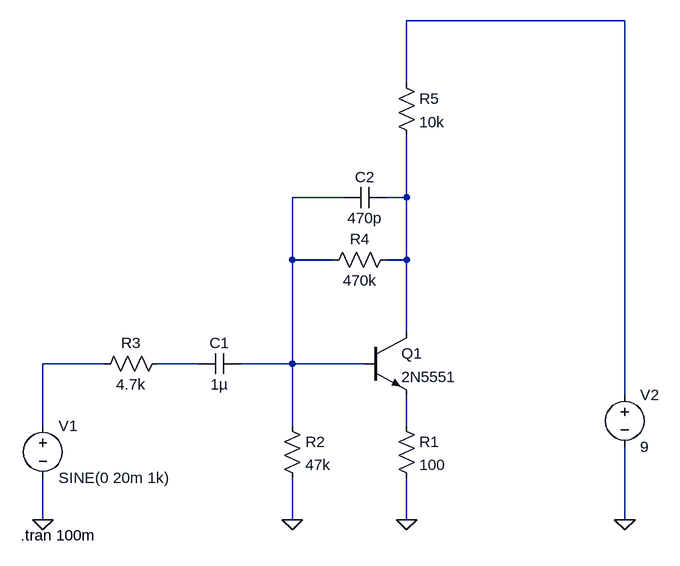
[diagram p0: schematic input_bjt_stage.asc]
input_bjt_stage.asc, the LTspice schematic file:
Version 4
SHEET 1 880 680
WIRE 576 -352 240 -352
WIRE 240 -256 240 -352
WIRE 144 -80 64 -80
WIRE 240 -80 240 -176
WIRE 240 -80 208 -80
WIRE 64 16 64 -80
WIRE 128 16 64 16
WIRE 240 16 240 -80
WIRE 240 16 208 16
WIRE 240 128 240 16
WIRE -224 176 -320 176
WIRE -80 176 -144 176
WIRE 64 176 64 16
WIRE 64 176 -16 176
WIRE 176 176 64 176
WIRE 576 224 576 -352
WIRE -320 272 -320 176
WIRE 64 272 64 176
WIRE 240 272 240 224
WIRE -320 416 -320 352
WIRE 64 416 64 352
WIRE 240 416 240 352
WIRE 576 416 576 304
FLAG 240 416 0
FLAG 64 416 0
FLAG 576 416 0
FLAG -320 416 0
SYMBOL npn 176 128 R0
SYMATTR InstName Q1
SYMATTR Value 2N5551
SYMBOL res 224 256 R0
SYMATTR InstName R1
SYMATTR Value 100
SYMBOL res 48 256 R0
SYMATTR InstName R2
SYMATTR Value 47k
SYMBOL res -128 160 R90
WINDOW 0 0 56 VBottom 2
WINDOW 3 32 56 VTop 2
SYMATTR InstName R3
SYMATTR Value 4.7k
SYMBOL cap -16 160 R90
WINDOW 0 0 32 VBottom 2
WINDOW 3 32 32 VTop 2
SYMATTR InstName C1
SYMATTR Value 1µ
SYMBOL res 224 0 R90
WINDOW 0 0 56 VBottom 2
WINDOW 3 32 56 VTop 2
SYMATTR InstName R4
SYMATTR Value 470k
SYMBOL cap 208 -96 R90
WINDOW 0 0 32 VBottom 2
WINDOW 3 32 32 VTop 2
SYMATTR InstName C2
SYMATTR Value 470p
SYMBOL res 224 -272 R0
SYMATTR InstName R5
SYMATTR Value 10k
SYMBOL voltage -320 256 R0
WINDOW 123 0 0 Left 0
WINDOW 39 0 0 Left 0
SYMATTR InstName V1
SYMATTR Value SINE(0 20m 1k)
SYMBOL voltage 576 208 R0
WINDOW 123 0 0 Left 0
WINDOW 39 0 0 Left 0
SYMATTR InstName V2
SYMATTR Value 9
TEXT -354 440 Left 2 !.tran 100m

The netlist it stands for:
* input_bjt_stage.asc
Q1 N003 N002 N006 0 2N5551
R1 N006 0 100
R2 N002 0 47k
R3 N005 N004 4.7k
C1 N002 N005 1µ
R4 N003 N002 470k
C2 N003 N002 470p
R5 N001 N003 10k
V1 N004 0 SINE(0 20m 1k)
V2 N001 0 9
.model NPN NPN
.model PNP PNP
.lib standard.bjt
.tran 100m
.backanno
.end